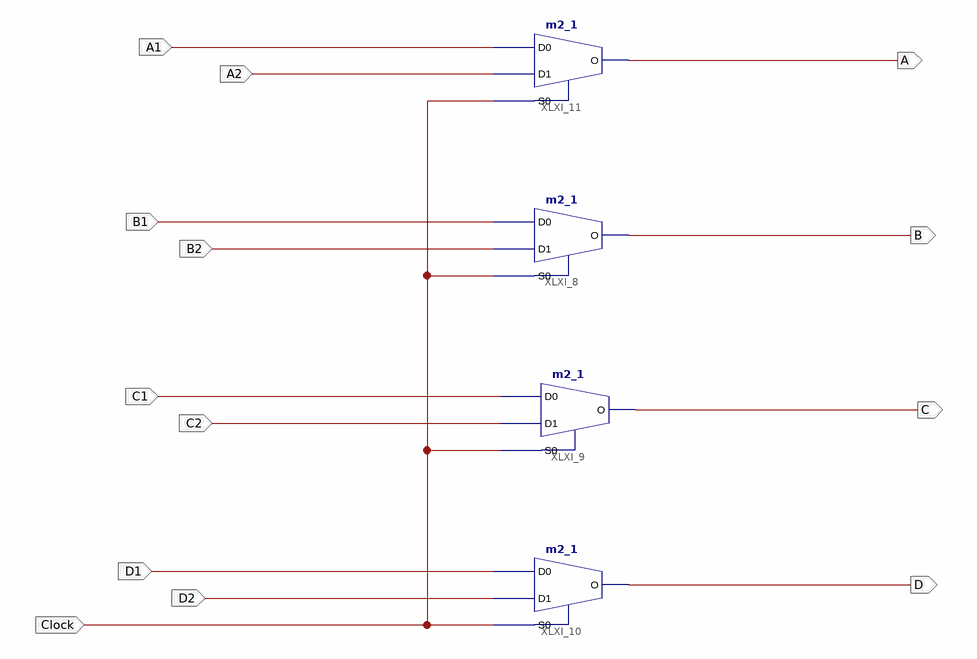
[diagram p0: schematic sheet 1]
// Xilinx ISE schematic Display.sch (spartan6) as structural Verilog: 4 symbols, 13 ports
module Display (
  input  A1,
  input  B1,
  input  C1,
  input  A2,
  input  B2,
  input  C2,
  input  D2,
  input  D1,
  input  Clock,
  output A,
  output B,
  output C,
  output D
);

  m2_1 XLXI_8 (.D0(B1), .D1(B2), .S0(Clock), .O(B));
  m2_1 XLXI_9 (.D0(C1), .D1(C2), .S0(Clock), .O(C));
  m2_1 XLXI_10 (.D0(D1), .D1(D2), .S0(Clock), .O(D));
  m2_1 XLXI_11 (.D0(A1), .D1(A2), .S0(Clock), .O(A));
endmodule
